# EAGLE design BDCMC_H-Bridge_24V50A (EAGLE 7.2.0)
CNAME: OKSOKO Corp.; CREVISION: 2.1.5; DESIGNER: Umur Ozhan SENGUL
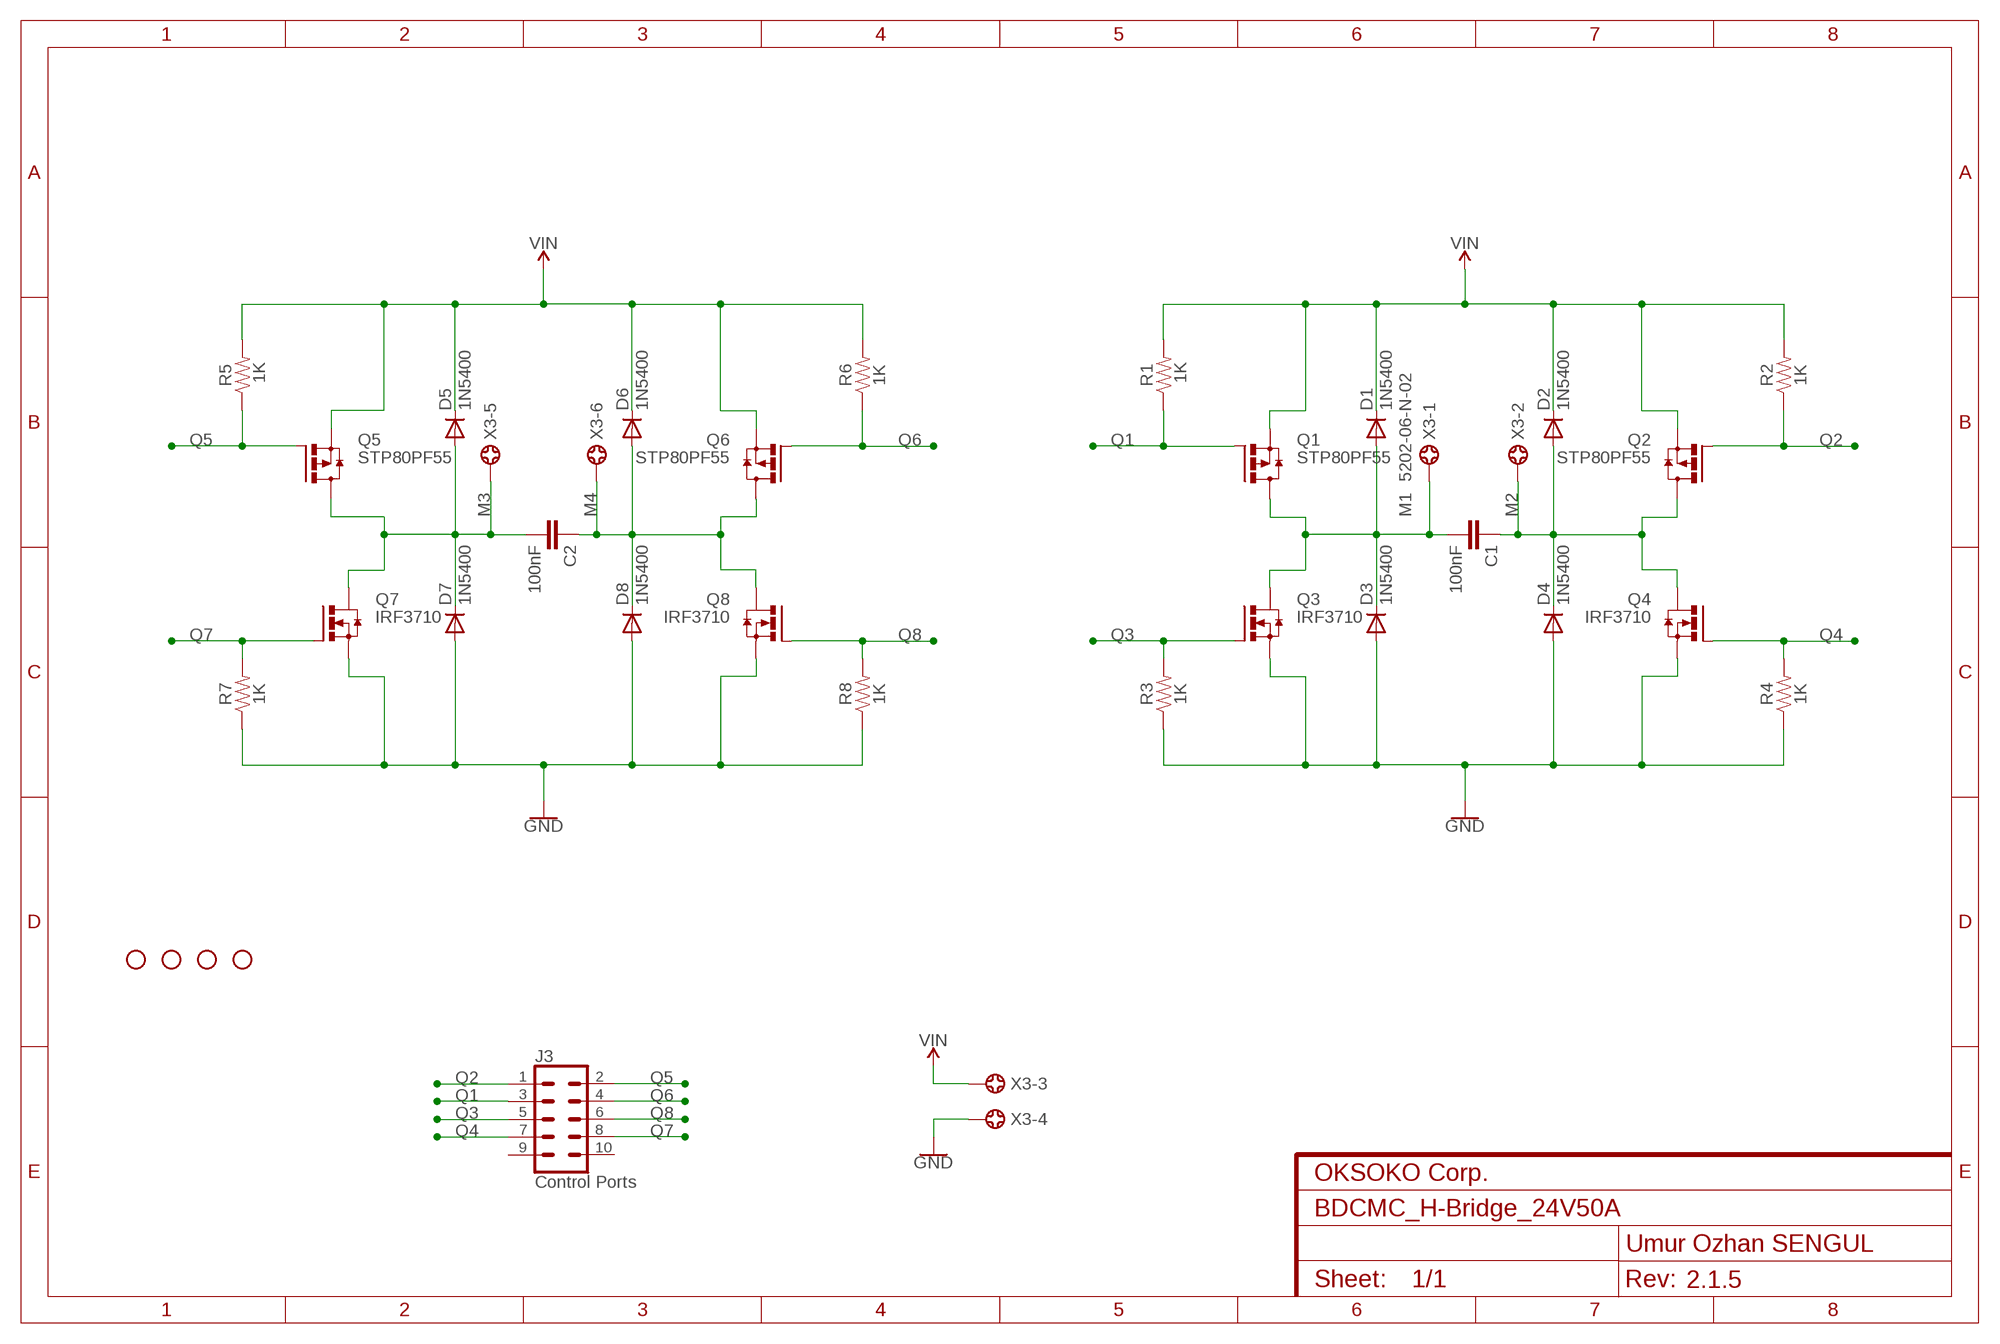
[diagram p0: schematic, sheet 1]

## Parts
C1  100nF  22PF-PTH-2.54MM-200V-5%  [CAP-PTH-2.54]
C2  100nF  22PF-PTH-2.54MM-200V-5%  [CAP-PTH-2.54]
D1  1N5400  [DO201-15]
D2  1N5400  [DO201-15]
D3  1N5400  [DO201-15]
D4  1N5400  [DO201-15]
D5  1N5400  [DO201-15]
D6  1N5400  [DO201-15]
D7  1N5400  [DO201-15]
D8  1N5400  [DO201-15]
H1  STAND-OFF  [STAND-OFF]
H2  STAND-OFF  [STAND-OFF]
H3  STAND-OFF  [STAND-OFF]
H4  STAND-OFF  [STAND-OFF]
J3  Control Ports  CONN_05X2SHD  [2X5-SHROUDED]
Q1  STP80PF55  [TO220]
Q2  STP80PF55  [TO220]
Q3  IRF3710  [TO220BH]
Q4  IRF3710  [TO220BH]
Q5  STP80PF55  [TO220]
Q6  STP80PF55  [TO220]
Q7  IRF3710  [TO220BH]
Q8  IRF3710  [TO220BH]
R1  1K  RESISTORAXIAL-0.3  [AXIAL-0.3]
R2  1K  RESISTORAXIAL-0.3  [AXIAL-0.3]
R3  1K  RESISTORAXIAL-0.3  [AXIAL-0.3]
R4  1K  RESISTORAXIAL-0.3  [AXIAL-0.3]
R5  1K  RESISTORAXIAL-0.3  [AXIAL-0.3]
R6  1K  RESISTORAXIAL-0.3  [AXIAL-0.3]
R7  1K  RESISTORAXIAL-0.3  [AXIAL-0.3]
R8  1K  RESISTORAXIAL-0.3  [AXIAL-0.3]
X3  5202-06-N-02  [5202-06-N-02]

## Nets
GND: D3.A D4.A D7.A D8.A Q3.S Q4.S Q7.S Q8.S R3.P$1 R4.P$1 R7.P$1 R8.P$1 X3.4
M1: C1.2 D1.A D3.C Q1.D Q3.D X3.1
M2: C1.1 D2.A D4.C Q2.D Q4.D X3.2
M3: C2.2 D5.A D7.C Q5.D Q7.D X3.5
M4: C2.1 D6.A D8.C Q6.D Q8.D X3.6
Q1: J3.3 Q1.G R1.P$1
Q2: J3.1 Q2.G R2.P$1
Q3: J3.5 Q3.G R3.P$2
Q4: J3.7 Q4.G R4.P$2
Q5: J3.2 Q5.G R5.P$1
Q6: J3.4 Q6.G R6.P$1
Q7: J3.8 Q7.G R7.P$2
Q8: J3.6 Q8.G R8.P$2
VIN: D1.C D2.C D5.C D6.C Q1.S Q2.S Q5.S Q6.S R1.P$2 R2.P$2 R5.P$2 R6.P$2 X3.3
Unconnected: J3.9 J3.10

## Library data of the parts
C1 C2 = SparkFun_Capacitors:22PF: 22pF ceramic capacitors A capacitor is a passive two-terminal electrical component used to store electrical energy temporarily in an electric field.; PROD_ID: CAP-09128; VALUE: 22pF
D1-D8 = diyModules_diode:1N5400: DIODE standard rectifier, 3 A, 50 V (Motorola)
H1-H4 = SparkFun_Hardware:STAND-OFF: Stand Off Drill holes for mechanically mounting via screws, standoffs, etc. Note: Use the keepout ring to avoid running the screw head into surrounding components. Variant Overviews STAND-OFF - Mechanical footprint for a #4 phillips button head screw. STAND-OFF-TIGHT - Mechanical footprint for a #4 phillips button head screw, Example SparkFun Products Screw - Phillips Head (1/4", 4-40, 10 pack) <https://www.sparkfun.com/products/10453> (PRT-10453) Screw - Phillips Head (1/2", 4-40, 10 pack) <https://www.sparkfun.com/products/10452> (PRT-10452) Screw - Phillips Head (3/4", 4-40, 10 pack) <https://www.sparkfun.com/products/10451> (PRT-10451) Screw - Phillips Head (1", 4-40, 10 pack) <https://www.sparkfun.com/products/10450> (PRT-10450)
J3 = SparkFun_Connectors:CONN_05X2: Multi connection point. Often used as Generic Header-pin footprint for 0.1 inch spaced/style header connections For AVR SPI programming port, see special device with nice symbol: "AVR_SPI_PROG_5x2.dev" You can populate with any combo of single row headers, but if you'd like an exact match, check these: 2x5 AVR ICSP Male Header <https://www.sparkfun.com/products/778> (PRT-00778) 2x5 Pin Shrouded Header <https://www.sparkfun.com/products/8506> (PRT-08506) On any of the 0.1 inch spaced packages, you can populate with these: Break Away Headers - Straight <https://www.sparkfun.com/products/116> (PRT-00116) Break Away Male Headers - Right Angle <https://www.sparkfun.com/products/553> (PRT-00553) Female Headers <https://www.sparkfun.com/products/115> (PRT-00115) Break Away Headers - Machine Pin <https://www.sparkfun.com/products/117> (PRT-00117) Break Away Female Headers - Swiss Machine Pin <https://www.sparkfun.com/products/743> (PRT-00743) Special note: the shrouded connector mates well with our 5x2 ribbon cables: 2x5 Pin IDC Ribbon Cable <https://www.sparkfun.com/products/8535> (PRT-08535); PROD_ID: CONN-08671; SF_ID: PRT-08506
Q1 Q2 Q5 Q6 = transistor-power:STP80PF55: P-Channel HEXFET 55V 80A
Q3 Q4 Q7 Q8 = transistor-power:IRF3710: N-Channel HEXFET 100V 57A
R1-R8 = SparkFun_Resistors:RESISTOR: Generic Resistor Package
X3 = con-ebyelectro:5202-06-N-02: Barrier Blocks Sreies 5202 Source: http://www.ebyelectro.com/PDF/5202-XX-N-02.pdf; OC_FARNELL: unknown; OC_NEWARK: unknown

## Board
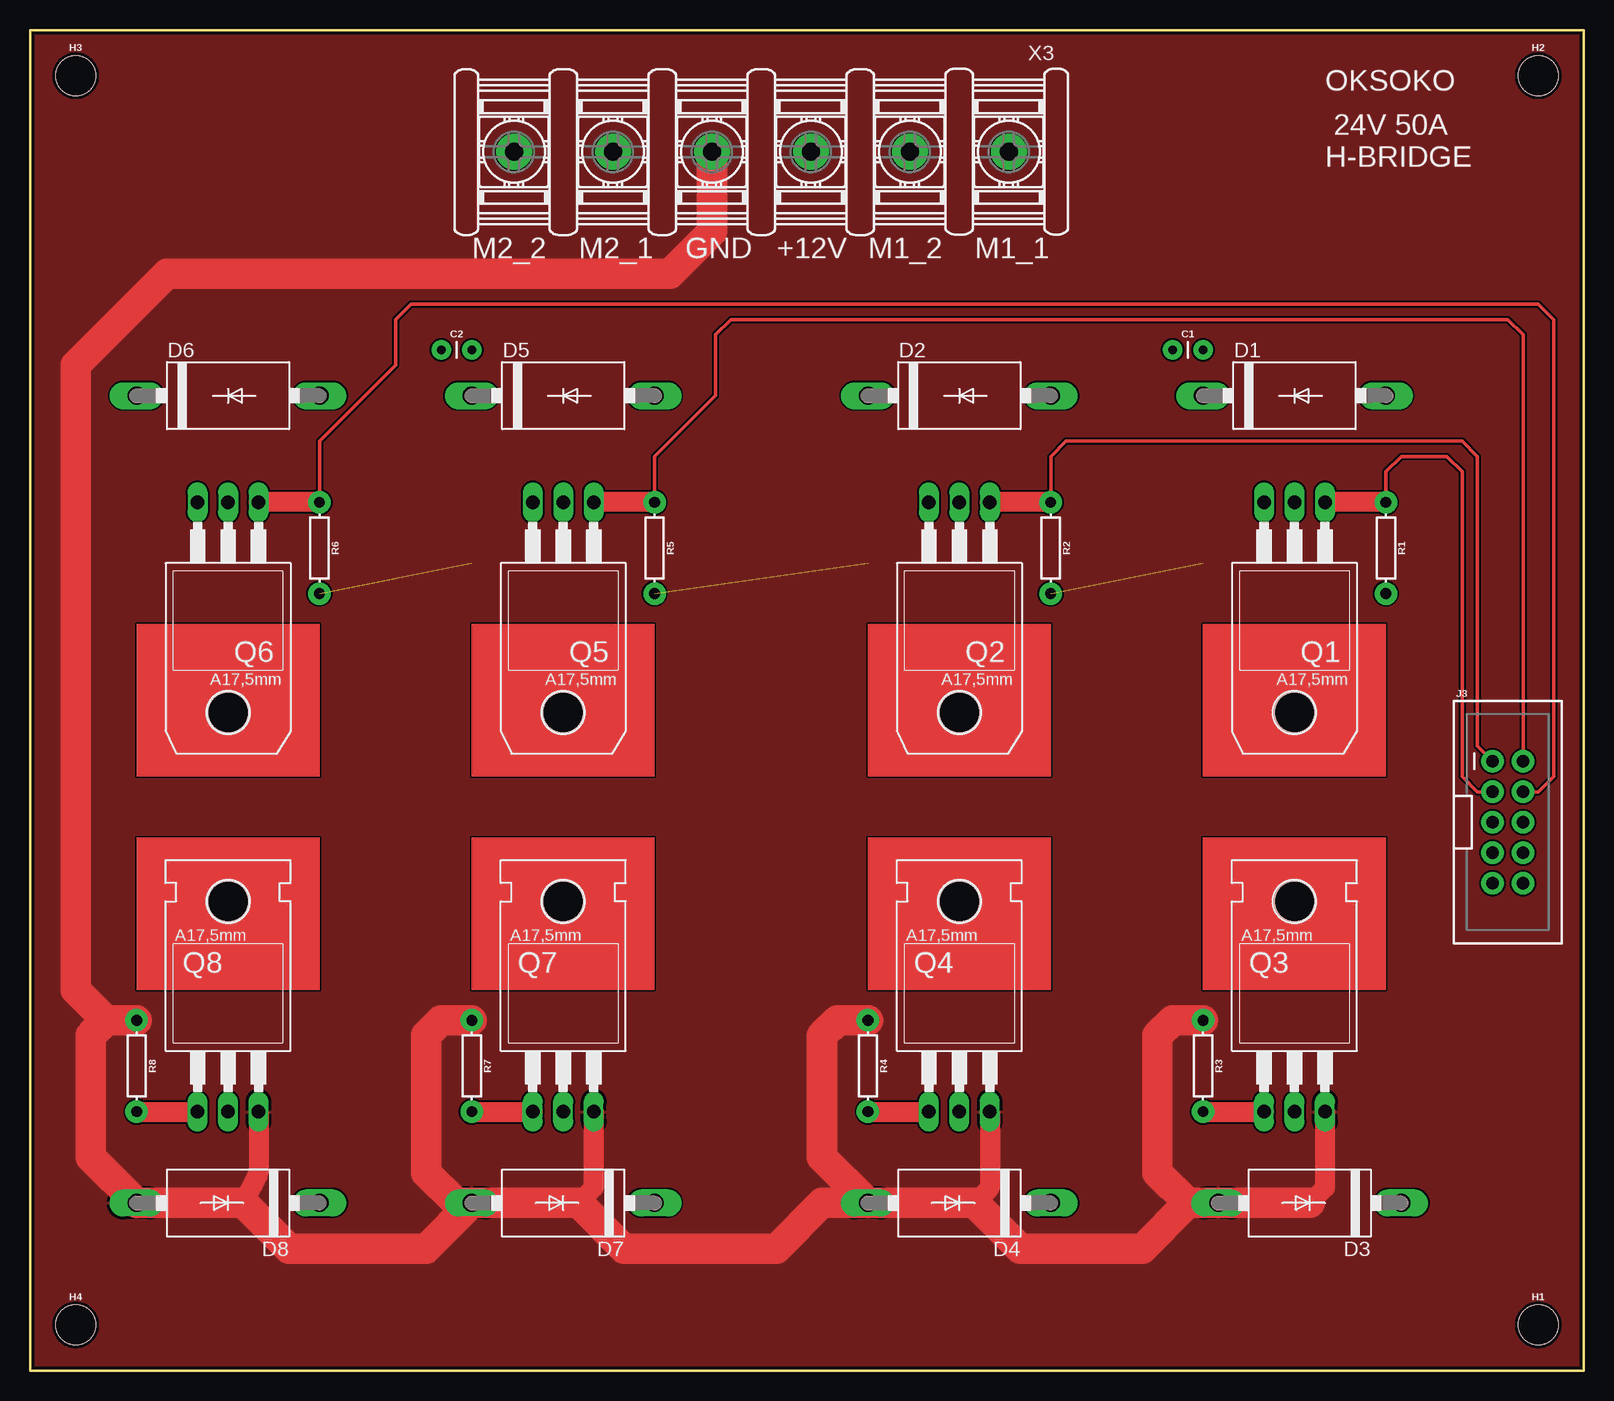
[diagram p1: board, top side]
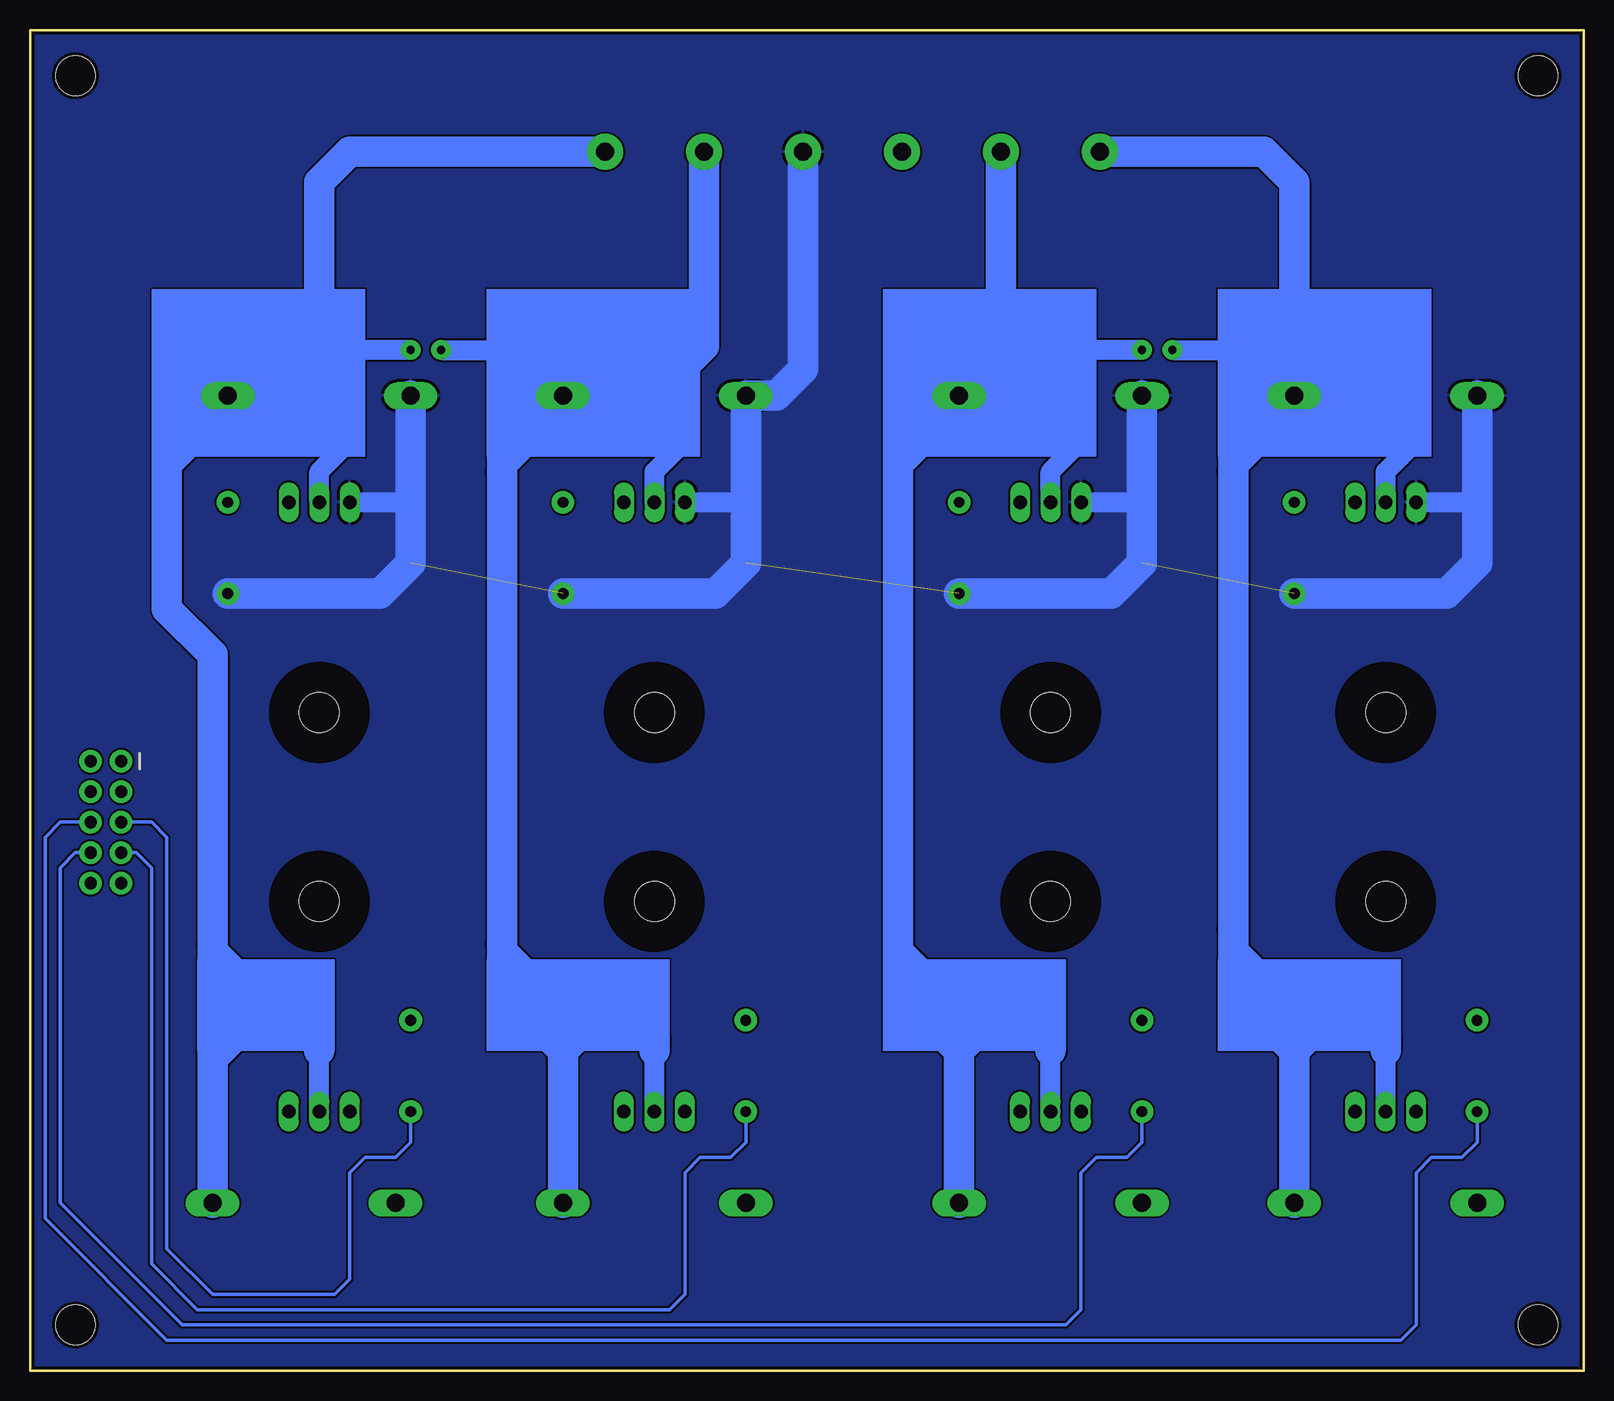
[diagram p2: board, bottom side, seen from below]

Size 129.52 x 111.76 mm. Coordinates in mm from the lower left corner, seen from the top.
Outline: 0,0 129.52,0 129.52,111.76 0,111.76 0,0
Copper layers (1*16): Top 0.035mm / dielectric 1.5mm / Bottom 0.035mm
Design rules "SeeedStudio_2layer_DRU_no_angle_20140221": minimum track width 6mil, minimum drill 12mil, track to track 6mil, track to pad 6mil, pad to pad 6mil, via to via 6mil, smd to smd 0mil, copper to edge 10mil, drill to drill 10mil, minimum pad ring 10mil, minimum via ring 6mil, stop-mask expansion 2mil, vias tented up to drill 100mil, thermal gap 10mil

### Footprints (pad centres in the part's own frame; a part is rotated, then mirrored left to right if it is on the bottom)
CAP-PTH-2.54 = drill 0.7 pad 1.651: 1 -1.27,0; 2 1.27,0
DO201-15 = drill 1.499 long: A 7.62,0; C -7.62,0
STAND-OFF = hole 3.302: 0,0
2X5-SHROUDED = drill 1.016 pad 1.88: 1 -1.27,5.08; 2 1.27,5.08; 3 -1.27,2.54; 4 1.27,2.54; 5 -1.27,0; 6 1.27,0; 7 -1.27,-2.54; 8 1.27,-2.54; 9 -1.27,-5.08; 10 1.27,-5.08
TO220 = drill 1.118 long: D 0,-6.35; G -2.54,-6.35; S 2.54,-6.35 | hole 3.302: 0,11.176
TO220BH = drill 1.118 long: D 0,-6.35; G -2.54,-6.35; S 2.54,-6.35 | hole 3.302: 0,11.176
AXIAL-0.3 = drill 0.9 pad 1.88: P$1 -3.81,0; P$2 3.81,0
5202-06-N-02 = drill 1.5 pad 3: 1 -20.625,0; 2 -12.375,0; 3 -4.125,0; 4 4.125,0; 5 12.375,0; 6 20.625,0

### Placement (x,y rotation side)
C1  96.52,85.09 0 top
C2  35.56,85.09 0 top
D1  105.41,81.28 0 top
D2  77.47,81.28 0 top
D3  106.68,13.97 180 top
D4  77.47,13.97 180 top
D5  44.45,81.28 0 top
D6  16.51,81.28 0 top
D7  44.45,13.97 180 top
D8  16.51,13.97 180 top
H1  125.73,3.81 0 top
H2  125.73,107.95 0 top
H3  3.81,107.95 0 top
H4  3.81,3.81 0 top
J3  123.19,45.72 0 top
Q1  105.41,66.04 180 top
Q2  77.47,66.04 180 top
Q3  105.41,27.94 0 top
Q4  77.47,27.94 0 top
Q5  44.45,66.04 180 top
Q6  16.51,66.04 180 top
Q7  44.45,27.94 0 top
Q8  16.51,27.94 0 top
R1  113.03,68.58 270 top
R2  85.09,68.58 270 top
R3  97.79,25.4 270 top
R4  69.85,25.4 270 top
R5  52.07,68.58 270 top
R6  24.13,68.58 270 top
R7  36.83,25.4 270 top
R8  8.89,25.4 270 top
X3  60.96,101.6 180 top

### Tracks (layer width: path | path; a pad name or v marks a point on that pad's centre or on a via)
GND
  Top 1.676: Q8.S 19.05,16.51 17.78,13.97 | Q4.S 80.01,15.24 78.74,13.97 | Q3.S 107.95,15.24 106.68,13.97 | Q7.S 46.99,15.24 45.72,13.97
  Top 2.54: R4.P$1 67.31,29.21 66.04,27.94 66.04,17.78 D4.A | R7.P$1 34.29,29.21 33.02,27.94 33.02,16.51 35.56,13.97 D7.A | D7.A 33.02,10.16 21.59,10.16 17.78,13.97 D8.A 5.08,17.78 5.08,27.94 6.35,29.21 | R8.P$1 6.35,29.21 | D4.A 78.74,13.97 82.55,10.16 92.71,10.16 96.52,13.97 | 96.52,13.97 D3.A 106.68,13.97 | R3.P$1 95.25,29.21 93.98,27.94 93.98,16.51 96.52,13.97 | D4.A 66.04,13.97 62.23,10.16 49.53,10.16 45.72,13.97 D7.A | X3.4 56.84,94.94 53.34,91.44 11.43,91.44 3.81,83.82 3.81,31.75 6.35,29.21
  Bottom 1.676: 7.62,13.97 D8.A | D7.A 35.56,13.97
  pour Top: 0,0 129.54,0 129.54,111.76 0,111.76
M1
  Bottom 1.676: Q3.D 105.41,26.67 | 114.3,25.4 111.76,27.94 | 114.3,35.56 111.76,33.02 | 118.11,74.93 115.57,77.47 | C1.2 105.41,85.09 105.41,83.82 | Q1.D 105.41,74.93 102.87,77.47 102.87,80.01
  Bottom 2.54: X3.1 102.87,101.6 105.41,99.06 105.41,83.82 105.41,81.28 | 105.41,81.28 D1.A 116.84,81.28 118.11,80.01 118.11,74.93 118.11,63.5 114.3,59.69 114.3,35.56 114.3,31.75 | 105.41,81.28 104.14,81.28 102.87,80.01 | D3.C 114.3,25.4 114.3,31.75 | 105.41,26.67 105.41,27.94 106.68,29.21 111.76,29.21 114.3,31.75
M2
  Bottom 1.676: Q4.D 77.47,27.94 | 90.17,35.56 87.63,33.02 | 90.17,74.93 87.63,77.47 | C1.1 81.28,85.09 81.28,81.28 | Q2.D 77.47,74.93 74.93,77.47 74.93,80.01
  Bottom 2.54: X3.2 73.33,85.42 77.47,81.28 | 77.47,81.28 81.28,81.28 D2.A 88.9,81.28 90.17,80.01 90.17,74.93 90.17,35.56 90.17,31.75 85.09,26.67 | D4.C 85.09,26.67 | 85.09,26.67 82.55,29.21 78.74,29.21 77.47,27.94 77.47,26.67 | 77.47,81.28 76.2,81.28 74.93,80.01
M3
  Bottom 1.676: Q7.D 44.45,26.67 | 57.15,35.56 54.61,33.02 | 57.15,74.93 54.61,77.47 | C2.2 48.9,85.09 48.9,84.45 | Q5.D 44.45,74.93 41.91,77.47 41.91,80.01
  Bottom 2.54: X3.5 48.59,84.77 48.9,84.45 D5.A | D7.C 52.07,26.67 | D5.A 54.61,81.28 57.15,78.74 57.15,74.93 57.15,35.56 57.15,31.75 52.07,26.67 | D5.A 43.18,81.28 41.91,80.01 | 52.07,26.67 49.53,29.21 45.72,29.21 44.45,27.94 44.45,26.67
M4
  Bottom 1.676: Q8.D 16.51,26.67 | 29.21,36.83 29.21,35.56 26.67,33.02 | 29.21,74.93 26.67,77.47 | C2.1 24.13,85.09 24.13,83.82 | Q6.D 16.51,74.93 15.24,76.2 | 15.24,76.2 13.97,77.47 | 15.24,76.2 15.24,78.74 13.97,80.01
  Bottom 2.54: D6.A 24.13,83.82 24.13,99.06 26.67,101.6 X3.6 | D8.C 24.13,26.67 | D6.A 26.67,81.28 29.21,78.74 29.21,74.93 29.21,36.83 29.21,31.75 24.13,26.67 | 24.13,26.67 21.59,29.21 17.78,29.21 16.51,27.94 16.51,26.67 | D6.A 15.24,81.28 13.97,80.01
Q1
  Top 0.305: J3.3 120.65,48.26 119.38,49.53 119.38,74.93 118.11,76.2 114.3,76.2 113.03,74.93 R1.P$1
  Top 1.676: R1.P$1 Q1.G
Q2
  Top 0.305: J3.1 120.65,52.07 120.65,76.2 119.38,77.47 86.36,77.47 85.09,76.2 R2.P$1
  Top 1.676: R2.P$1 Q2.G
Q3
  Top 1.676: R3.P$2 Q3.G
  Bottom 0.305: R3.P$2 97.79,19.05 99.06,17.78 101.6,17.78 102.87,16.51 102.87,7.62 104.14,6.35 114.3,6.35 118.11,10.16 118.11,44.45 119.38,45.72 J3.5
Q4
  Top 1.676: R4.P$2 Q4.G
  Bottom 0.305: R4.P$2 69.85,19.05 71.12,17.78 73.66,17.78 74.93,16.51 74.93,6.35 76.2,5.08 115.57,5.08 119.38,8.89 119.38,41.91 120.65,43.18 J3.7
Q5
  Top 0.305: R5.P$1 52.07,76.2 57.15,81.28 57.15,86.36 58.42,87.63 123.19,87.63 124.46,86.36 J3.2
  Top 1.676: R5.P$1 Q5.G
Q6
  Top 0.305: R6.P$1 24.13,77.47 30.48,83.82 30.48,87.63 31.75,88.9 125.73,88.9 127,87.63 127,49.53 125.73,48.26 J3.4
  Top 1.676: R6.P$1 Q6.G
Q7
  Top 1.676: R7.P$2 Q7.G
  Bottom 0.305: R7.P$2 36.83,19.05 38.1,17.78 40.64,17.78 41.91,16.51 41.91,5.08 43.18,3.81 116.84,3.81 127,13.97 127,41.91 125.73,43.18 J3.8
Q8
  Top 1.676: R8.P$2 Q8.G
  Bottom 0.305: R8.P$2 8.89,19.05 10.16,17.78 12.7,17.78 13.97,16.51 13.97,3.81 15.24,2.54 118.11,2.54 128.27,12.7 128.27,44.45 127,45.72 J3.6
VIN  (3 unrouted)
  Bottom 1.676: Q6.S 8.89,72.39 | Q5.S 36.83,72.39 | Q2.S 69.85,72.39 | Q1.S 97.79,72.39
  Bottom 2.54: R2.P$2 72.39,64.77 69.85,67.31 69.85,72.39 D2.C 67.31,81.28 65.08,83.5 X3.3 | R1.P$2 100.33,64.77 97.79,67.31 97.79,72.39 D1.C | D5.C 36.83,72.39 36.83,67.31 39.37,64.77 R5.P$2 | D6.C 8.89,72.39 8.89,67.31 11.43,64.77 R6.P$2
  pour Bottom: 0,0 129.54,0 129.54,111.76 0,111.76
(copper drawn outside any net)
  shapes: Bottom area x8, Top area x8

### Text on the board
tNames: OKSOKO | 24V 50A / H-BRIDGE | M2_2 | M2_1 | GND | +12V | M1_2 | M1_1